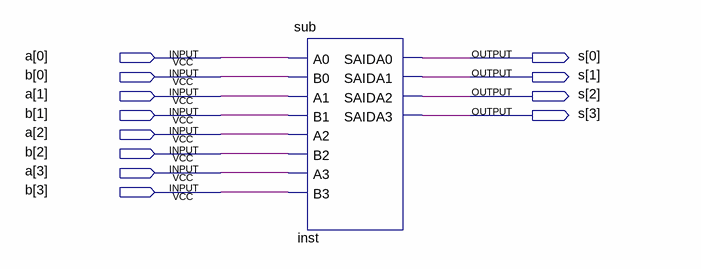
[diagram p0: schematic sheet]
// Quartus schematic testezinho.bdf as structural Verilog: 1 symbols, 12 pins
module testezinho (
  input  [3:0] a,
  input  [3:0] b,
  output [3:0] s
);

  sub inst (
    .A0(a[0]), .B0(b[0]), .A1(a[1]), .B1(b[1]), .A2(a[2]), .B2(b[2]), .A3(a[3]), .B3(b[3]), .SAIDA0(s[0]),
    .SAIDA1(s[1]), .SAIDA2(s[2]), .SAIDA3(s[3]));
endmodule
